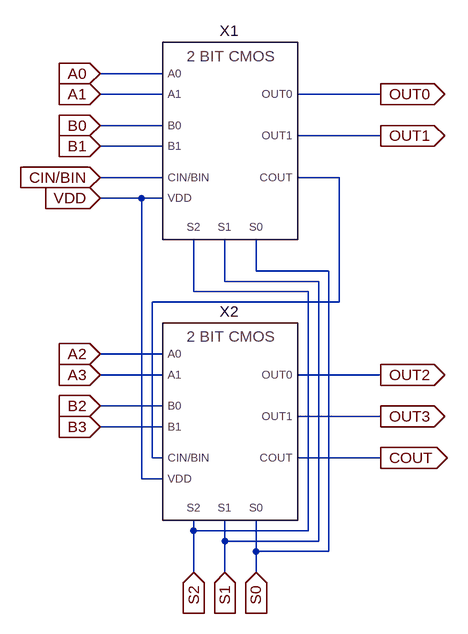
[diagram p0: schematic Draft6.asc]
Draft6.asc, the LTspice schematic file:
Version 4
SHEET 1 880 888
WIRE 128 32 32 32
WIRE 128 64 32 64
WIRE 464 64 336 64
WIRE 128 112 32 112
WIRE 464 128 336 128
WIRE 128 144 32 144
WIRE 128 192 32 192
WIRE 400 192 336 192
WIRE 96 224 32 224
WIRE 128 224 96 224
WIRE 272 336 272 288
WIRE 384 336 272 336
WIRE 224 352 224 288
WIRE 368 352 224 352
WIRE 176 368 176 288
WIRE 352 368 176 368
WIRE 400 384 400 192
WIRE 400 384 112 384
WIRE 128 464 32 464
WIRE 128 496 32 496
WIRE 464 496 336 496
WIRE 128 544 32 544
WIRE 464 560 336 560
WIRE 128 576 32 576
WIRE 112 624 112 384
WIRE 128 624 112 624
WIRE 464 624 336 624
WIRE 96 656 96 224
WIRE 128 656 96 656
WIRE 176 736 176 720
WIRE 352 736 352 368
WIRE 352 736 176 736
WIRE 224 752 224 720
WIRE 368 752 368 352
WIRE 368 752 224 752
WIRE 272 768 272 720
WIRE 384 768 384 336
WIRE 384 768 272 768
WIRE 176 800 176 736
WIRE 224 800 224 752
WIRE 272 800 272 768
FLAG 32 32 A0
IOPIN 32 32 In
FLAG 32 64 A1
IOPIN 32 64 In
FLAG 32 112 B0
IOPIN 32 112 In
FLAG 32 144 B1
IOPIN 32 144 In
FLAG 32 192 CIN/BIN
IOPIN 32 192 In
FLAG 32 224 VDD
IOPIN 32 224 In
FLAG 464 64 OUT0
IOPIN 464 64 Out
FLAG 464 128 OUT1
IOPIN 464 128 Out
FLAG 464 496 OUT2
IOPIN 464 496 Out
FLAG 464 560 OUT3
IOPIN 464 560 Out
FLAG 464 624 COUT
IOPIN 464 624 Out
FLAG 176 800 S2
IOPIN 176 800 In
FLAG 224 800 S1
IOPIN 224 800 In
FLAG 272 800 S0
IOPIN 272 800 In
FLAG 32 464 A2
IOPIN 32 464 In
FLAG 32 496 A3
IOPIN 32 496 In
FLAG 32 544 B2
IOPIN 32 544 In
FLAG 32 576 B3
IOPIN 32 576 In
SYMBOL twoBitALU_CMOS 224 144 R0
SYMATTR InstName X1
SYMBOL twoBitALU_CMOS 224 576 R0
SYMATTR InstName X2

The netlist it stands for:
* Draft6.asc
XX1 A0 A1 B0 B1 CIN/BIN S0 S1 S2 VDD N001 OUT0 OUT1 twoBitALU_CMOS  ; pins A0 A1 B0 B1 CIN/BIN S0 S1 S2 VDD COUT OUT0 OUT1
XX2 A2 A3 B2 B3 N001 S0 S1 S2 VDD COUT OUT2 OUT3 twoBitALU_CMOS  ; pins A0 A1 B0 B1 CIN/BIN S0 S1 S2 VDD COUT OUT0 OUT1
.backanno
.end